# Altium schematic sheet CPU_CORE_POWER_GND.SchDoc
size A3; SheetNumber: 5; SheetTotal: 18
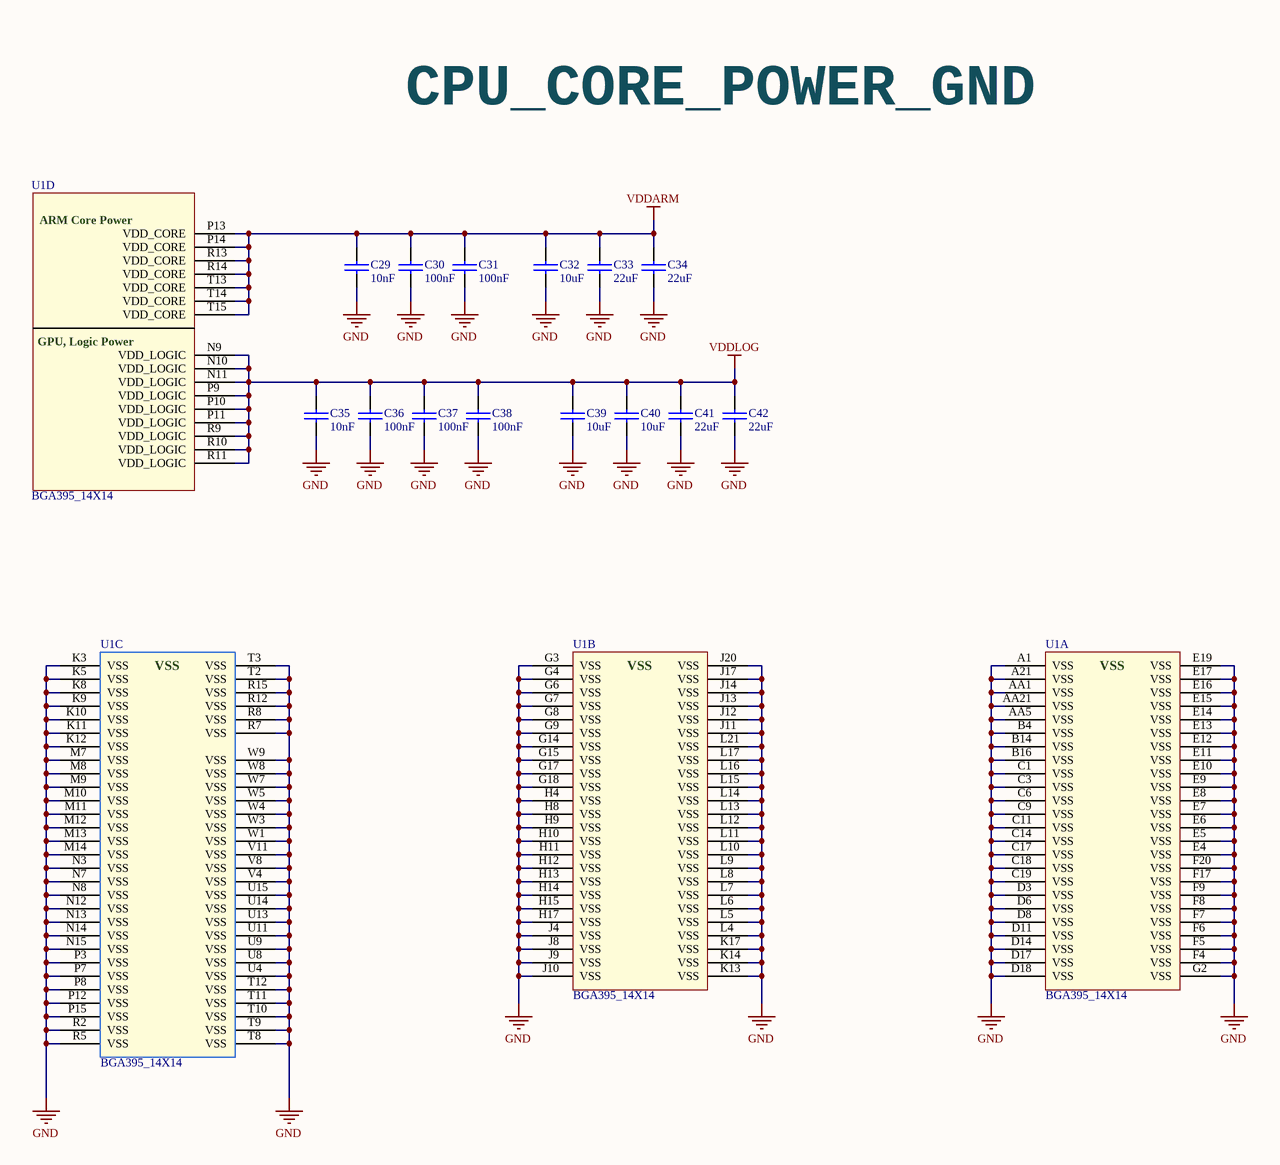
[diagram p0: CPU_CORE_POWER_GND.SchDoc]

## Parts
C29  10nF  [0402_CC - C]
C30  100nF  [0402_CC - C]
C31  100nF  [0402_CC - C]
C32  10uF  [0603_CC]
C33  22uF  [0603_CC]
C34  22uF  [0603_CC]
C35  10nF  [0402_CC - C]
C36  100nF  [0402_CC - C]
C37  100nF  [0402_CC - C]
C38  100nF  [0402_CC - C]
C39  10uF  [0603_CC]
C40  10uF  [0603_CC]
C41  22uF  [0603_CC]
C42  22uF  [0603_CC]
U1  BGA395_14X14  [BGA395C65P21X21_1750X1750X117]  (parts A,B,C,D of 17)

## Nets
GND: C29.2 C30.2 C31.2 C32.2 C33.2 C34.2 C35.2 C36.2 C37.2 C38.2 C39.2 C40.2 C41.2 C42.2 U1.A1(VSS) U1.A21(VSS) U1.AA1(VSS) U1.AA5(VSS) U1.AA21(VSS) U1.B4(VSS) U1.B14(VSS) U1.B16(VSS) U1.C1(VSS) U1.C3(VSS) U1.C6(VSS) U1.C9(VSS) U1.C11(VSS) U1.C14(VSS) U1.C17(VSS) U1.C18(VSS) U1.C19(VSS) U1.D3(VSS) U1.D6(VSS) U1.D8(VSS) U1.D11(VSS) U1.D14(VSS) U1.D17(VSS) U1.D18(VSS) U1.E4(VSS) U1.E5(VSS) U1.E6(VSS) U1.E7(VSS) U1.E8(VSS) U1.E9(VSS) U1.E10(VSS) U1.E11(VSS) U1.E12(VSS) U1.E13(VSS) U1.E14(VSS) U1.E15(VSS) U1.E16(VSS) U1.E17(VSS) U1.E19(VSS) U1.F4(VSS) U1.F5(VSS) U1.F6(VSS) U1.F7(VSS) U1.F8(VSS) U1.F9(VSS) U1.F17(VSS) U1.F20(VSS) U1.G2(VSS) U1.G3(VSS) U1.G4(VSS) U1.G6(VSS) U1.G7(VSS) U1.G8(VSS) U1.G9(VSS) U1.G14(VSS) U1.G15(VSS) U1.G17(VSS) U1.G18(VSS) U1.H4(VSS) U1.H8(VSS) U1.H9(VSS) U1.H10(VSS) U1.H11(VSS) U1.H12(VSS) U1.H13(VSS) U1.H14(VSS) U1.H15(VSS) U1.H17(VSS) U1.J4(VSS) U1.J8(VSS) U1.J9(VSS) U1.J10(VSS) U1.J11(VSS) U1.J12(VSS) U1.J13(VSS) U1.J14(VSS) U1.J17(VSS) U1.J20(VSS) U1.K3(VSS) U1.K5(VSS) U1.K8(VSS) U1.K9(VSS) U1.K10(VSS) U1.K11(VSS) U1.K12(VSS) U1.K13(VSS) U1.K14(VSS) U1.K17(VSS) U1.L4(VSS) U1.L5(VSS) U1.L6(VSS) U1.L7(VSS) U1.L8(VSS) U1.L9(VSS) U1.L10(VSS) U1.L11(VSS) U1.L12(VSS) U1.L13(VSS) U1.L14(VSS) U1.L15(VSS) U1.L16(VSS) U1.L17(VSS) U1.L21(VSS) U1.M7(VSS) U1.M8(VSS) U1.M9(VSS) U1.M10(VSS) U1.M11(VSS) U1.M12(VSS) U1.M13(VSS) U1.M14(VSS) U1.N3(VSS) U1.N7(VSS) U1.N8(VSS) U1.N12(VSS) U1.N13(VSS) U1.N14(VSS) U1.N15(VSS) U1.P3(VSS) U1.P7(VSS) U1.P8(VSS) U1.P12(VSS) U1.P15(VSS) U1.R2(VSS) U1.R5(VSS) U1.R7(VSS) U1.R8(VSS) U1.R12(VSS) U1.R15(VSS) U1.T2(VSS) U1.T3(VSS) U1.T8(VSS) U1.T9(VSS) U1.T10(VSS) U1.T11(VSS) U1.T12(VSS) U1.U4(VSS) U1.U8(VSS) U1.U9(VSS) U1.U11(VSS) U1.U13(VSS) U1.U14(VSS) U1.U15(VSS) U1.V4(VSS) U1.V8(VSS) U1.V11(VSS) U1.W1(VSS) U1.W3(VSS) U1.W4(VSS) U1.W5(VSS) U1.W7(VSS) U1.W8(VSS) U1.W9(VSS)
VDDARM: C29.1 C30.1 C31.1 C32.1 C33.1 C34.1 U1.P13(VDD_CORE) U1.P14(VDD_CORE) U1.R13(VDD_CORE) U1.R14(VDD_CORE) U1.T13(VDD_CORE) U1.T14(VDD_CORE) U1.T15(VDD_CORE)
VDDLOG: C35.1 C36.1 C37.1 C38.1 C39.1 C40.1 C41.1 C42.1 U1.N9(VDD_LOGIC) U1.N10(VDD_LOGIC) U1.N11(VDD_LOGIC) U1.P9(VDD_LOGIC) U1.P10(VDD_LOGIC) U1.P11(VDD_LOGIC) U1.R9(VDD_LOGIC) U1.R10(VDD_LOGIC) U1.R11(VDD_LOGIC)

## Notes on the sheet
- CPU_CORE_POWER_GND
- (in symbol RK3328, part D) ARM Core Power; GPU, Logic Power

## Library data of the parts
C29-C42 = CAP_NP: CLASS: DISCRETE
U1 = RK3328: By AAR